# Altium project PCB_3U_DDS.PrjPCB (part 2 of 5)

## Sheet DDS_OUT_channel.SchDoc: Output stage :
size 420 x 297 mm; Author: G.K.; CompanyName: WUT; DrawnBy: G.K.; Organization: WUT ISE; Address1: Warsaw Univeristy of Technology; Address2: Nowowiejska 15/19; DocumentNumber: 4; Revision: -; SheetNumber: 4; SheetTotal: 7; EDA_Number: ARTIQ; Projet: ARTIQ/SINARA; ModifiedBy: -; CreateDate: XX/XX/XXXX; CheckedDate: -; Title2: Attenuator, amplifier and filter; DivGrp: ISE; Designer: G.K.; ModifiedDate: -; ProjectName: ARTIQ/SINARA
Used 4 times, as channels U_DDS_OUT_channel0, U_DDS_OUT_channel1, U_DDS_OUT_channel2, U_DDS_OUT_channel3. Parts and nets are listed once, with the designators drawn on the sheet.
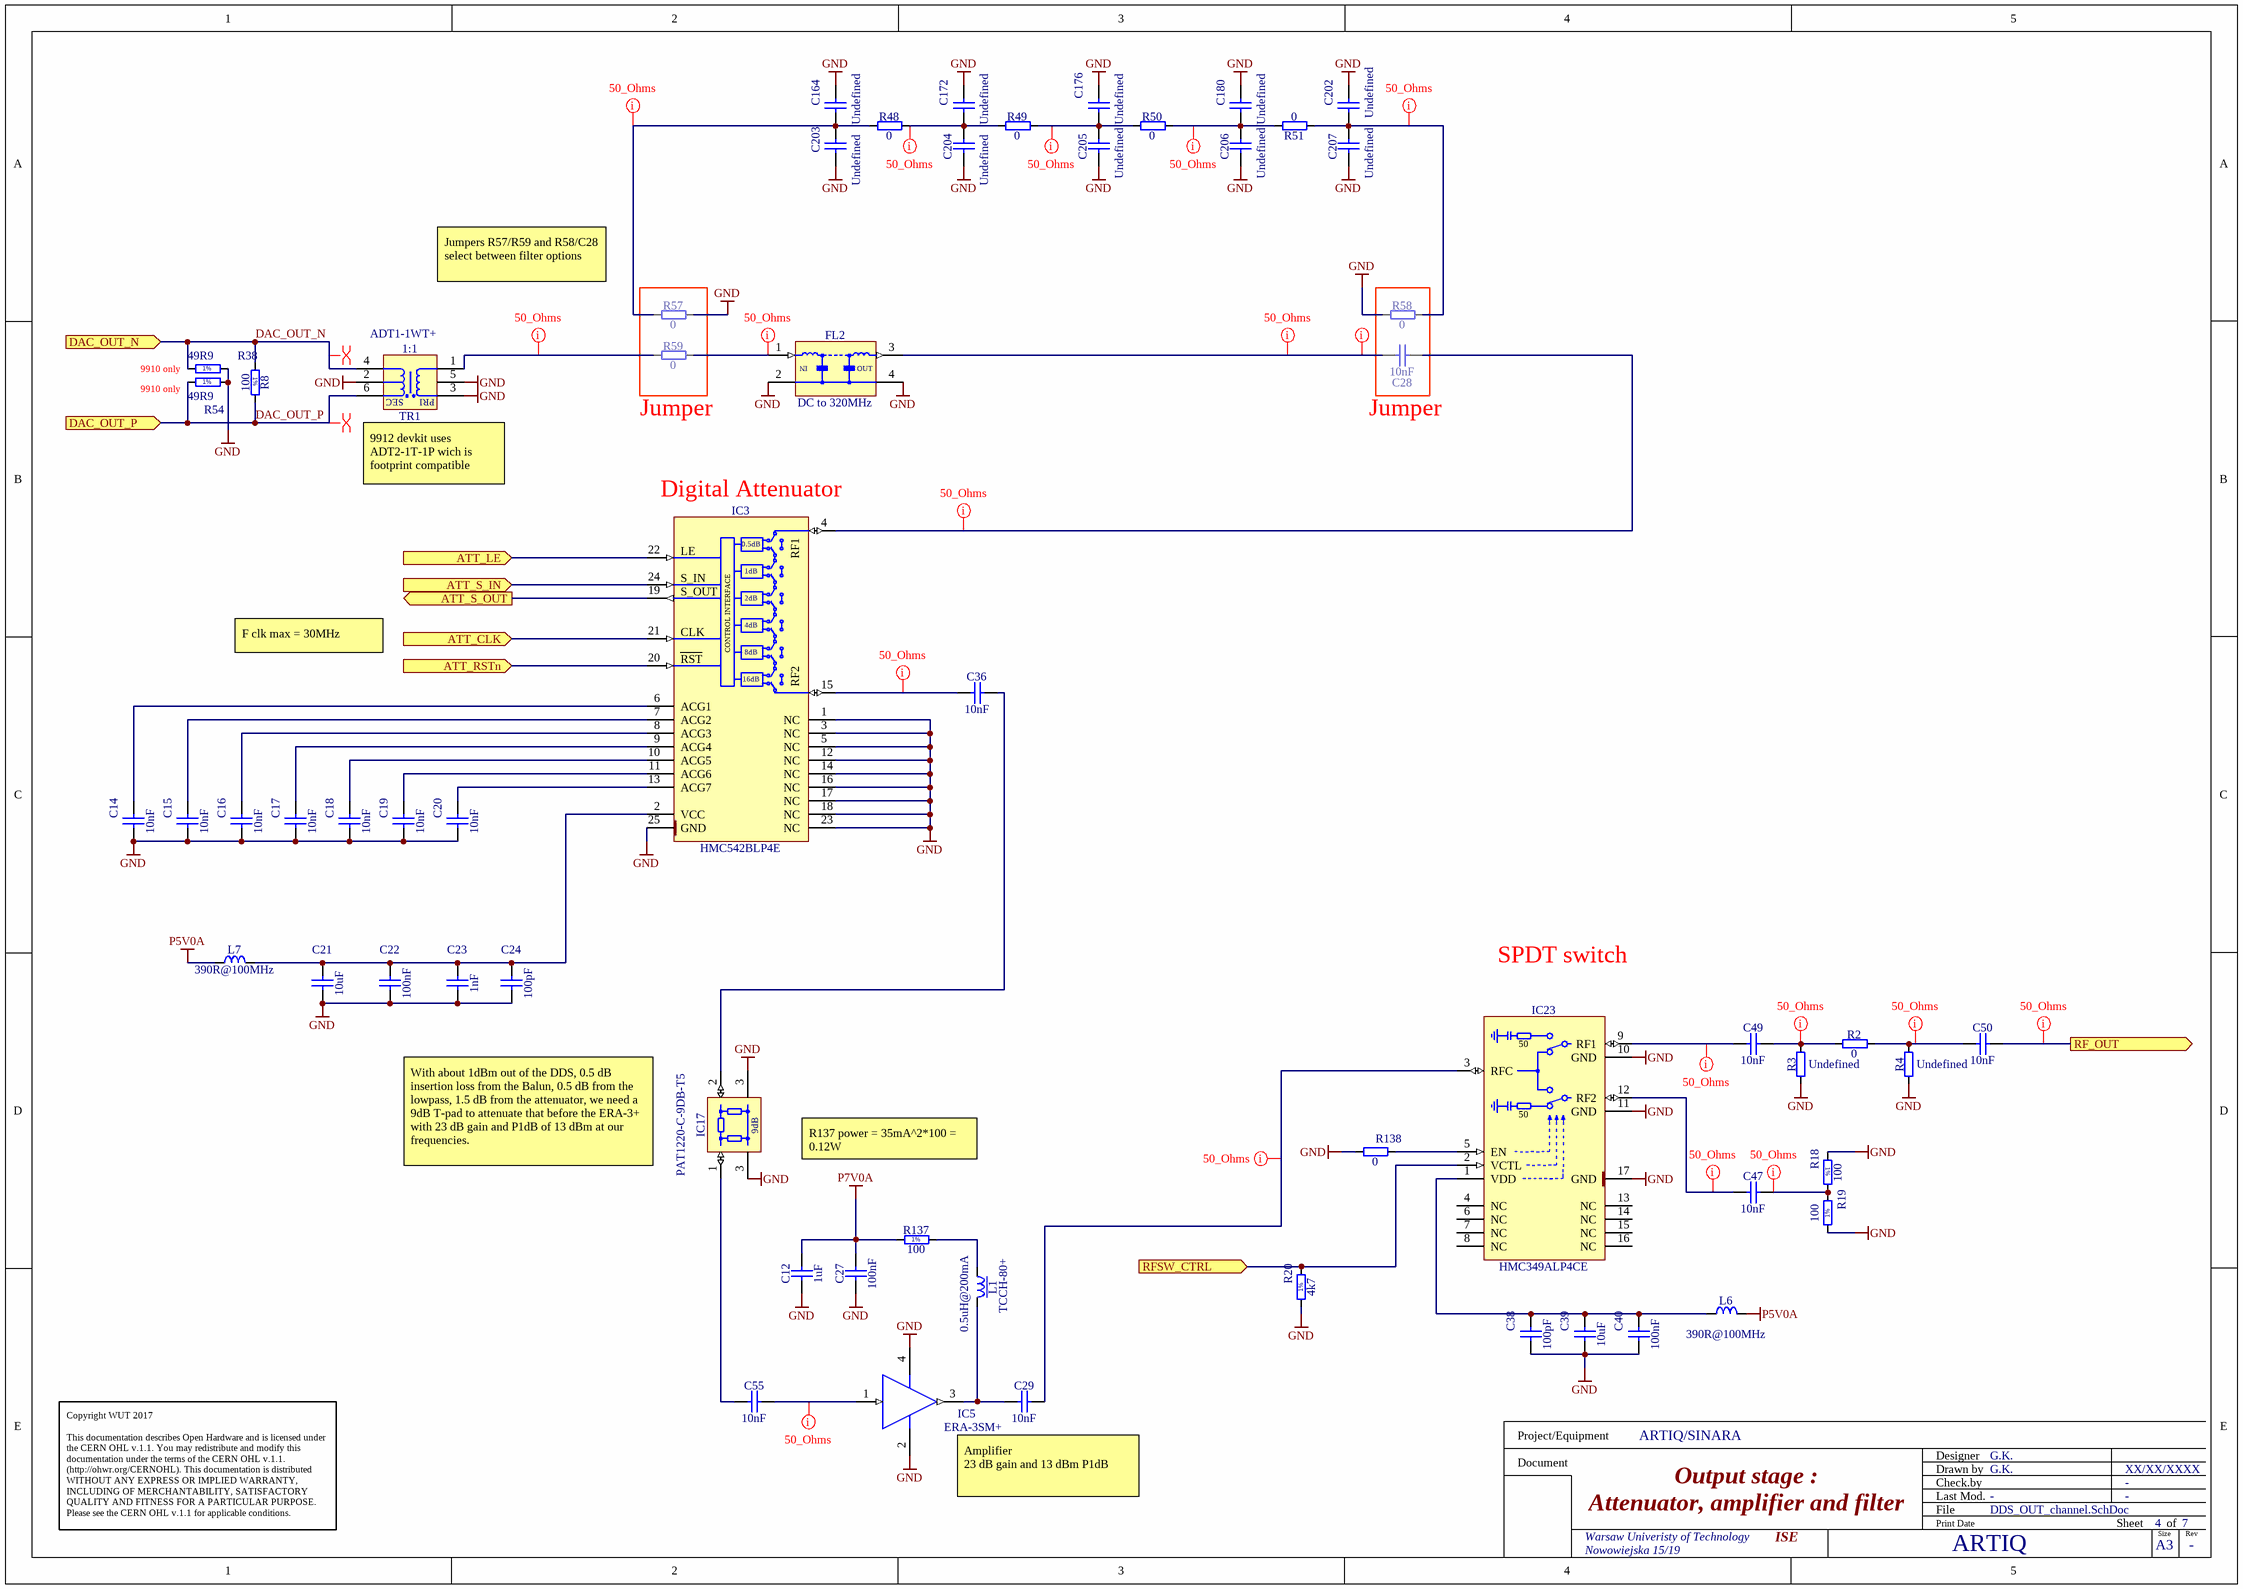
[diagram p1: DDS_OUT_channel.SchDoc]

### Parts
C12  1uF  [CAPC2012X140N]
C14  10nF  [CAPC1005X55N]
C15  10nF  [CAPC1005X55N]
C16  10nF  [CAPC1005X55N]
C17  10nF  [CAPC1005X55N]
C18  10nF  [CAPC1005X55N]
C19  10nF  [CAPC1005X55N]
C20  10nF  [CAPC1005X55N]
C21  10uF  [CAPC1608X80N]
C22  100nF  [CAPC1005X55N]
C23  1nF  [CAPC1005X55N]
C24  100pF  [CAPC1005X55N]
C27  100nF  [CAPC1005X55N]
C28  10nF  [CAPC1005X55N]
C29  10nF  [CAPC1005X55N]
C36  10nF  [CAPC1005X55N]
C38  100pF  [CAPC1005X55N]
C39  10uF  [CAPC1608X80N]
C40  100nF  [CAPC1005X55N]
C47  10nF  [CAPC1005X55N]
C49  10nF  [CAPC1005X55N]
C50  10nF  [CAPC1005X55N]
C55  10nF  [CAPC1005X55N]
C164  Undefined  [CAPC1005X55N]
C172  Undefined  [CAPC1005X55N]
C176  Undefined  [CAPC1005X55N]
C180  Undefined  [CAPC1005X55N]
C202  Undefined  [CAPC1005X55N]
C203  Undefined  [CAPC1005X55N]
C204  Undefined  [CAPC1005X55N]
C205  Undefined  [CAPC1005X55N]
C206  Undefined  [CAPC1005X55N]
C207  Undefined  [CAPC1005X55N]
FL2  DC to 320MHz  [FIL_MINI-CIRCUITS_FV1206]
IC3  HMC542BLP4E  [QFN50P400X400X100-25N-S295]
IC5  ERA-3SM+  [MINI-CIRCUITS_WW107]
IC17  PAT1220-C-9DB-T5  [SUSUMU_PAT1220]
IC23  HMC349ALP4CE  [QFN65P400X400X100-17N-S255]
L1  0.5uH@200mA  Manufacturer Part Number: TCCH-80+  [IND_MINI-CIRCUITS_GU1604]
L6  390R@100MHz  [INDC1608X95N]
L7  390R@100MHz  [INDC1608X95N]
R2  0  [RESC1005X40N]
R3  Undefined  [RESC1005X40N]
R4  Undefined  [RESC1005X40N]
R8  100  [RESC1005X40N]
R18  100  [RESC1005X40N]
R19  100  [RESC1005X40N]
R20  4k7  [RESC1005X40N]
R38  49R9  [RESC1005X40N]
R48  0  [RESC1005X40N]
R49  0  [RESC1005X40N]
R50  0  [RESC1005X40N]
R51  0  [RESC1005X40N]
R54  49R9  [RESC1005X40N]
R57  0  [RESC1005X40N]
R58  0  [RESC1005X40N]
R59  0  [RESC1005X40N]
R137  100  [RESC3216X65N]
R138  0  [RESC1005X40N]
TR1  1:1  Manufacturer Part Number: ADT1-1WT+  [XFMR_MINI-CIRCUITS_CD542]

### Ports
ATT_CLK (in), ATT_LE (in), ATT_RSTn (in), ATT_S_IN (in), ATT_S_OUT (out), DAC_OUT_N (in), DAC_OUT_P (in), RF_OUT (out), RFSW_CTRL (in)

### Nets
GND: C12.1 C14.1 C15.1 C16.1 C17.1 C18.1 C19.1 C20.1 C21.1 C22.1 C23.1 C24.1 C27.1 C38.2 C39.1 C40.1 C164.2 C172.2 C176.2 C180.2 C202.2 C203.1 C204.1 C205.1 C206.1 C207.1 FL2.2(GND) FL2.4(GND) IC3.1(NC) IC3.3(NC) IC3.5(NC) IC3.12(NC) IC3.14(NC) IC3.16(NC) IC3.17(NC) IC3.18(NC) IC3.23(NC) IC3.25(GND) IC5.2(GND) IC5.4(GND) IC17.3(GND) IC23.10(GND) IC23.11(GND) IC23.17(GND) R3.1 R4.1 R18.1 R19.1 R20.1 R38.2 R54.2 R57.2 R58.2 R138.1 TR1.2(SCT) TR1.3(PDOT) TR1.5(NC)
P5V0A: L6.2 L7.1
P7V0A: C12.2 C27.2 R137.1
ATT_CLK: IC3.21(SHIFT_CLOCK) ; port ATT_CLK
ATT_LE: IC3.22(LATCH_ENABLE) ; port ATT_LE
ATT_RSTn: IC3.20(~{RESET}) ; port ATT_RSTn
ATT_S_IN: IC3.24(SERIAL_INPUT) ; port ATT_S_IN
ATT_S_OUT: IC3.19(SERIAL_OUTPUT) ; port ATT_S_OUT
DAC_OUT_N: R8.1 R38.1 TR1.4(S) ; port DAC_OUT_N
DAC_OUT_P: R8.2 R54.1 TR1.6(SDOT) ; port DAC_OUT_P
RF_OUT: C50.2 ; port RF_OUT
RFSW_CTRL: IC23.2(VCTL) R20.2 ; port RFSW_CTRL
NetC14_2: C14.2 IC3.6(ACG1)
NetC15_2: C15.2 IC3.7(ACG2)
NetC16_2: C16.2 IC3.8(ACG3)
NetC17_2: C17.2 IC3.9(ACG4)
NetC18_2: C18.2 IC3.10(ACG5)
NetC19_2: C19.2 IC3.11(ACG6)
NetC20_2: C20.2 IC3.13(ACG7)
NetC21_2: C21.2 C22.2 C23.2 C24.2 IC3.2(VCC) L7.2
NetC28_1: C28.1 FL2.3(RFOUT)
NetC28_2: C28.2 IC3.4(RF1)
NetC29_1: C29.1 IC5.3(RF_OUT) L1.3
NetC29_2: C29.2 IC23.3(RFC)
NetC36_1: C36.1 IC3.15(RF2)
NetC36_2: C36.2 IC17.2(OUT)
NetC38_1: C38.1 C39.2 C40.2 IC23.1(VDD) L6.1
NetC47_1: C47.1 IC23.12(RF2)
NetC47_2: C47.2 R18.2 R19.2
NetC49_1: C49.1 IC23.9(RF1)
NetC49_2: C49.2 R2.1 R3.2
NetC50_1: C50.1 R2.2 R4.2
NetC55_1: C55.1 IC17.1(IN)
NetC55_2: C55.2 IC5.1(RF_IN)
NetC164_1: C164.1 C203.2 R48.1 R57.1
NetC172_1: C172.1 C204.2 R48.2 R49.1
NetC176_1: C176.1 C205.2 R49.2 R50.1
NetC180_1: C180.1 C206.2 R50.2 R51.2
NetC202_1: C202.1 C207.2 R51.1 R58.1
NetFL2_1: FL2.1(RFIN) R59.2
NetIC23_5: IC23.5(EN) R138.2
NetL1_1: L1.1 R137.2
NetR59_1: R59.1 TR1.1(P)

Not connected (* = marked no-connect by the designer): IC23 4(NC) 6(NC) 7(NC) 8(NC) 13(NC) 14(NC) 15(NC) 16(NC)

### Channels
U_DDS_OUT_channel0: designators end in A; ports ATT_CLK=ATT_CLK ATT_LE=ATT_LE ATT_RSTn=ATT_RSTn ATT_S_IN=ATT_S_IN ATT_S_OUT=NetIC3A_19 DAC_OUT_N=DAC_OUT_N DAC_OUT_P=DAC_OUT_P RF_OUT=RF_OUT0 RFSW_CTRL=RFSW_CTRL0
U_DDS_OUT_channel1: designators end in B; ports ATT_CLK=ATT_CLK ATT_LE=ATT_LE ATT_RSTn=ATT_RSTn ATT_S_IN=NetIC3A_19 ATT_S_OUT=NetIC3B_19 DAC_OUT_N=DAC_OUT_N DAC_OUT_P=DAC_OUT_P RF_OUT=RF_OUT1 RFSW_CTRL=RFSW_CTRL1
U_DDS_OUT_channel2: designators end in C; ports ATT_CLK=ATT_CLK ATT_LE=ATT_LE ATT_RSTn=ATT_RSTn ATT_S_IN=NetIC3B_19 ATT_S_OUT=NetIC3C_19 DAC_OUT_N=DAC_OUT_N DAC_OUT_P=DAC_OUT_P RF_OUT=RF_OUT2 RFSW_CTRL=RFSW_CTRL2
U_DDS_OUT_channel3: designators end in D; ports ATT_CLK=ATT_CLK ATT_LE=ATT_LE ATT_RSTn=ATT_RSTn ATT_S_IN=NetIC3C_19 ATT_S_OUT=ATT_S_OUT DAC_OUT_N=DAC_OUT_N DAC_OUT_P=DAC_OUT_P RF_OUT=RF_OUT3 RFSW_CTRL=RFSW_CTRL3

### Layout directives
net class 50_Ohms: NetC28A_1, NetC28A_2, NetC29A_2, NetC36A_1, NetC47A_1, NetC47A_2, NetC49A_1, NetC49A_2, NetC50A_1, NetC55A_2, NetC164A_1, NetC172A_1, NetC176A_1, NetC180A_1, NetC202A_1, NetFL2A_1, NetR59A_1, RF_OUT0
differential pair: DAC_OUT_N, DAC_OUT_P

### Notes on the sheet
- Jumpers R57/R59 and R58/C28 select between filter options
- 9910 only
- (near R59) Jumper
- (near C28) Jumper
- (near TR1) 9912 devkit uses ADT2-1T-1P wich is footprint compatible
- (near IC3) Digital Attenuator
- F clk max = 30MHz
- SPDT switch
- With about 1dBm out of the DDS, 0.5 dB insertion loss from the Balun, 0.5 dB from the lowpass, 1.5 dB from the attenuator, we need a 9dB T-pad to attenuate that before the ERA-3+ with 23 dB gain and P1dB of 13 dBm at our frequencies.
- R137 power = 35mA^2*100 = 0.12W
- Copyright WUT 2017
  This documentation describes Open Hardware and is licensed under the CERN OHL v.1.1. You may redistribute and modify this documentation under the terms of the CERN OHL v.1.1. (http://ohwr.org/CERNOHL). This documentation is distributed WITHOUT ANY EXPRESS OR IMPLIED WARRANTY, INCLUDING OF MERCHANTABILITY, SATISFACTORY QUALITY AND FITNESS FOR A PARTICULAR PURPOSE. Please see the CERN OHL v.1.1 for applicable conditions.
- Amplifier
  23 dB gain and 13 dBm P1dB
- Project/Equipment
- Document
- Designer
- Drawn by
- Check.by
- File
- Last Mod.
- Print Date
- Sheet
- Size
- A3
- of
- Rev
- (in symbol FIL_MINI-CIRCUITS_LFCN-320) IN; OUT
- (in symbol HMC349ALP4CE) 50
- (in symbol HMC542BLP4E) 0.5dB; LE; 1dB; S_IN; S_OUT; 2dB; CONTROL INTERFACE; 4dB; CLK; 8dB; RST; 16dB
- (in symbol R0402_4K7_1%_0.0625W_100PPM) 1%
- (in symbol R0402_49R9_1%_0.0625W_100PPM) 1%
- (in symbol R0402_100R_1%_0.0625W_100PPM) 1%
- (in symbol R1206_100R_1%_0.5W_100PPM_VISHAY_CRCW-HP e3) 1%
- (in symbol RF_PAT1220-C-9DB-T5) 9dB
- (in symbol XFMR_MINI-CIRCUITS_ADT1-1WT+) SEC; PRI

### Library data of the parts
C12 = CC0805_1UF_35V_20%_X7R: Non-polarised capacitor; Part Description: SMD Multilayer Chip Ceramic Capacitor; Manufacturer: GENERIC; Manufacturer1 Part Number: GMK212B7105MG-T; Voltage: 35V; TC: X7R; Tolerance: ±20%; Part Number: CC0805_1UF_35V_20%_X7R; Component Kind: Standard; Component Type: Standard; Pin Count: 2; Value: 1uF; Status: Not Recommended; Manufacturer Part Number: CC0805_1UF_35V_20%_X7R; Case: 0805; Mounted: Yes; Socket: No; SMD: Yes; Sense: No; Manufacturer1 Example: TAIYO YUDEN; Manufacturer1 ComponentHeight: 1.35mm; HelpURL: \\cern.ch\dfs\Applications\Altium\Datasheets\CC0805_X7R_TAIYO-YUDEN_HIGH-VALUE.pdf; Author: CERN DEM JLC; CreateDate: 2011-06-22; LatestRevisionDate: 2011-06-22
C14-C20 C28 C29 C36 C47 C49 C50 C55 = CC0402_10NF_16V_10%_X7R: Non-polarised capacitor; Part Description: SMD Multilayer Chip Ceramic Capacitor; Manufacturer: GENERIC; Manufacturer1 Part Number: 223878715636; Voltage: 16V; TC: X7R; Tolerance: ±10%; Part Number: CC0402_10NF_16V_10%_X7R; Component Kind: Standard; Component Type: Standard; Pin Count: 2; Value: 10nF; Status: Not Recommended; Manufacturer Part Number: CC0402_10NF_16V_10%_X7R; Case: 0402; Mounted: Yes; Socket: No; SMD: Yes; Sense: No; Manufacturer1 Example: PHYCOMP; Manufacturer1 ComponentHeight: 0.55mm; HelpURL: \\cern.ch\dfs\Applications\Altium\Datasheets\CC0402_X7R_PHYCOMP.pdf; Author: CERN DEM JLC; CreateDate: 2007-12-03; LatestRevisionDate: 2007-12-03
C21 C39 = CC0603_10UF_16V_20%_X5R: Non-polarised capacitor; Part Description: SMD Multilayer Chip Ceramic Capacitor; Manufacturer: GENERIC; Manufacturer1 Part Number: GRM188R61C106MA73D; Voltage: 16V; TC: X5R; Tolerance: ±20%; Part Number: CC0603_10UF_16V_20%_X5R; Component Kind: Standard; Component Type: Standard; Pin Count: 2; Value: 10uF; Status: None; Manufacturer Part Number: CC0603_10UF_16V_20%_X5R; Case: 0603; Mounted: Yes; Socket: No; SMD: Yes; Sense: No; Manufacturer1 Example: MURATA; Manufacturer1 ComponentHeight: 0.8mm; HelpURL: \\cern.ch\dfs\Applications\Altium\Datasheets\CC0603_X5R_MURATA_GRM.pdf; Author: CERN DEM MR; CreateDate: 2016-03-02; LatestRevisionDate: 2016-03-02
C22 = CC0402_100NF_16V_10%_X7R: Non-polarised capacitor; Part Description: SMD Multilayer Chip Ceramic Capacitor; Manufacturer: GENERIC; Manufacturer1 Part Number: GRM155R71C104KA88D; Voltage: 16V; TC: X7R; Tolerance: ±10%; Part Number: CC0402_100NF_16V_10%_X7R; Component Kind: Standard; Component Type: Standard; Pin Count: 2; Value: 100nF; Status: Not Recommended; Manufacturer Part Number: CC0402_100NF_16V_10%_X7R; Case: 0402; Mounted: Yes; Socket: No; SMD: Yes; Sense: No; Manufacturer1 Example: MURATA; Manufacturer1 ComponentHeight: 0.55mm; HelpURL: \\cern.ch\dfs\Applications\Altium\Datasheets\CC0402_X7R_MURATA_GRM.pdf; Author: CERN DEM JLC; CreateDate: 2013-12-05; LatestRevisionDate: 2007-12-03
C23 = CC0402_1NF_50V_10%_X7R: Non-polarised capacitor; Part Description: SMD Multilayer Chip Ceramic Capacitor; Manufacturer: GENERIC; Manufacturer1 Part Number: 223858715623; Voltage: 50V; TC: X7R; Tolerance: ±10%; Part Number: CC0402_1NF_50V_10%_X7R; Component Kind: Standard; Component Type: Standard; Pin Count: 2; Value: 1nF; Status: Not Recommended; Manufacturer Part Number: CC0402_1NF_50V_10%_X7R; Case: 0402; Mounted: Yes; Socket: No; SMD: Yes; Sense: No; Manufacturer1 Example: PHYCOMP; Manufacturer1 ComponentHeight: 0.55mm; HelpURL: \\cern.ch\dfs\Applications\Altium\Datasheets\CC0402_X7R_PHYCOMP.pdf; Author: CERN DEM JLC; CreateDate: 2007-12-03; LatestRevisionDate: 2007-12-03
C24 C38 = CC0402_100PF_50V_5%_C0G: Non-polarised capacitor; Part Description: SMD Multilayer Chip Ceramic Capacitor; Manufacturer: GENERIC; Manufacturer1 Part Number: C0402C101J5GACTU; Voltage: 50V; TC: C0G/NP0; Tolerance: ±5%; Part Number: CC0402_100PF_50V_5%_C0G; Component Kind: Standard; Component Type: Standard; Pin Count: 2; Value: 100pF; Status: Preferred; Manufacturer Part Number: CC0402_100PF_50V_5%_C0G; Case: 0402; Mounted: Yes; Socket: No; SMD: Yes; Sense: No; Manufacturer1 Example: KEMET; Manufacturer1 ComponentHeight: 0.55mm; HelpURL: \\cern.ch\dfs\Applications\Altium\Datasheets\CC0805_C0G_KEMET_(Commercial Grade).pdf; Author: CERN DEM JLC; CreateDate: 2007-12-03; LatestRevisionDate: 2015-04-22
C27 C40 = CC0402_100NF_16V_10%_X5R: Non-polarised capacitor; Part Description: SMD Multilayer Chip Ceramic Capacitor; Manufacturer: GENERIC; Manufacturer1 Part Number: GRM155R61C104KA88D; Voltage: 16V; TC: X5R; Tolerance: ±10%; Part Number: CC0402_100NF_16V_10%_X5R; Component Kind: Standard; Component Type: Standard; Pin Count: 2; Value: 100nF; Status: None; Manufacturer Part Number: CC0402_100NF_16V_10%_X5R; Case: 0402; Mounted: Yes; Socket: No; SMD: Yes; Sense: No; Manufacturer1 Example: MURATA; Manufacturer1 ComponentHeight: 0.55mm; HelpURL: \\cern.ch\dfs\Applications\Altium\Datasheets\CC0402_X5R_MURATA_GRM.pdf; Author: CERN DEM JLC; CreateDate: 10.12.2013; LatestRevisionDate: 10.12.2013
C164 C172 C176 C180 C202-C207 = CC0402_NO-VALUE: Non-polarised capacitor; Part Description: Reserved Footprint For 0402(1005) Chip Ceramic Capacitor; Mounted: No; Part Number: CC0402_NO-VALUE; Component Kind: Standard; Component Type: Standard; Pin Count: 2; Value: Undefined; Status: None; Manufacturer: Undefined; Manufacturer Part Number: CC0402_NO-VALUE; Case: 0402; Socket: No; SMD: Yes; Sense: No; Manufacturer1 ComponentHeight: 0.55mm; HelpURL: Undefined; Author: CERN DEM JLC; CreateDate: 14.01.2014; LatestRevisionDate: 14.01.2014
FL2 = FIL_MINI-CIRCUITS_LFCN-320: 50 Ohm DC to 320MHz Low Pass Filter; Part Description: 50 Ohm Low Pass Filter; Part Number: FIL_MINI-CIRCUITS_LFCN-320; Component Kind: Standard; Component Type: Standard; Pin Count: 2; Value: DC to 320MHz; Status: None; Manufacturer: MINI-CIRCUITS; Manufacturer Part Number: LFCN-320; Mounted: Yes; Socket: No; SMD: Yes; Sense: No; ComponentHeight: 0.94mm; HelpURL: \\cern.ch\dfs\Applications\Altium\Datasheets\FIL_MINI-CIRCUITS_LFCN-3000+.pdf; Author: CERN DEM JLC; CreateDate: 2013-12-09; LatestRevisionDate: 2013-12-09
IC3 = HMC542BLP4E: 0.5dB LSB GaAs MMIC 6-bit Digital Serial Control Attenuator, DC - 4GHz; Part Description: 0.5dB LSB GaAs MMIC 6-bit Digital Serial Control Attenuator, DC to 4GHz; Manufacturer: HITTITE MICROWAVE CORP; PressFit: No; Bonding: No; Part Number: HMC542BLP4E; Component Kind: Standard; Component Type: Standard; Device: HMC542BLP4E; PackageDescription: QFN, 0.50mm Pitch, Square; 24 Pin, 4.00mm L X 4.00mm W X 1.00mm H Body (w/thermal Tab 2.95 X 2.95mm), IPC Medium Density; Manufacturer Part Number: HMC542BLP4E; Pin Count: 25; Case: QFN24; Mounted: Yes; Socket: No; SMD: Yes; Sense: No; ComponentHeight: 1mm; Author: CERN DEM JMW; HelpURL: \\cern.ch\dfs\Applications\Altium\Datasheets\HMC542BLP4E.pdf; CreateDate: 2016-08-17; LatestRevisionDate: 2016-08-17
IC5 = RF_ERA-3SM+: DC-3GHz Monolithic Amplifier; Manufacturer: MINI-CIRCUITS; PressFit: No; Bonding: No; Part Number: ERA-3SM+; Component Kind: Standard; Component Type: Standard; Device: ERA-3SM+; PackageDescription: MINI-CIRCUITS WW107 Case, Body 2.16mm Diameter X 1.52mm H; Part Description: DC-3GHz Monolithic Amplifier; Manufacturer Part Number: ERA-3SM+; Pin Count: 4; Mounted: Yes; Socket: No; SMD: Yes; Sense: No; ComponentHeight: 1.52mm; Author: GK; HelpURL: \\cern.ch\dfs\Applications\Altium\Datasheets\ERA-4XSM+.pdf; CreateDate: 11.08.2016; LatestRevisionDate: 11.08.2016
IC17 = RF_PAT1220-C-9DB-T5: DC to 10GHz, 100mw, 50 Ohm, 9dB, Precision chip attenuator; Part Description: DC to 10GHz, 100mw, 50 Ohm, 9dB, Precision Chip 3dB Attenuator; Manufacturer: SUSUMU; PressFit: No; Sense Comment: Solder Paste Deposition Limitation; Bonding: No; Part Number: PAT1220-C-9DB-T5; Component Kind: Standard; Component Type: Standard; Device: PAT1220-C-9DB-T5; Footprint: SUSUMU_PAT1220-C-9DB-T5; PackageDescription: SUSUMU PAT1220, 4 Pin Attenuator, Sise 0402, L 1.00 x W 0.5 H 0.39mm; Status: Recommended; Manufacturer Part Number: PAT1220-C-9DB-T5; Pin Count: 4; Case: 0402; Mounted: Yes; Socket: No; SMD: Yes; Sense: Yes; ComponentHeight: 0.39mm; Author: GK; HelpURL: \\cern.ch\dfs\Applications\Altium\Datasheets\PAT0510S-C-9DB-T10.pdf; CreateDate: 09.03.2017; LatestRevisionDate: 02.05.2017
IC23 = HMC349ALP4CE: DC-4GHz High Isolation SPDT Non-Reflective Switch; Manufacturer: ANALOG DEVICES; PressFit: No; Bonding: No; Part Number: HMC349ALP4CE; Component Kind: Standard; Component Type: Standard; Device: HMC349ALP4CE; PackageDescription: QFN, 0.65mm pitch,square; 4 pin X 4 pin, 4mm X 4mm X 1mm H body (w/thermal tab 2.55 X 2.55mm),  IPC Medium Density; Part Description: DC-4GHz High Isolation SPDT Non-Reflective Switch; Manufacturer Part Number: HMC349ALP4CE; Pin Count: 17; Case: QFN16; Mounted: Yes; Socket: No; SMD: Yes; Sense: No; ComponentHeight: 1mm; Author: CERN DEM JLC; HelpURL: \\cern.ch\dfs\Applications\Altium\Datasheets\HMC349ALP4CE.pdf; CreateDate: 23.02.2017; LatestRevisionDate: 23.02.2017
L1 = IND_MINI-CIRCUITS_TCCH-80+: 50 Ohms, 50 to 8200 MHz RF Choke; Power: 200mA; Resistance: 0.1R; Part Number: IND_MINI-CIRCUITS_TCCH-80+; Component Kind: Standard; Component Type: Standard; Pin Count: 4; Value: 0.5uH@200mA; Status: None; Part Description: 50 Ohms, 50 to 8200 MHz RF Choke; Manufacturer: MINI-CIRCUITS; Mounted: Yes; Socket: No; SMD: Yes; Sense: No; ComponentHeight: 3.81mm; HelpURL: \\cern.ch\dfs\Applications\Altium\Datasheets\IND_MINI-CIRCUITS_TCCH-80+.pdf; Author: CERN DEM JLC; CreateDate: 2011-12-19; LatestRevisionDate: 2011-12-19
L6 L7 = IND0603_TDK_MPZ1608R391A: Inductor; Part Description: SMT Chip Bead for Power Line; Manufacturer: TDK; Power: 1.2A; Resistance: 0.12R; Tolerance: ±25%; Part Number: IND0603_TDK_MPZ1608R391A; Component Kind: Standard; Component Type: Standard; Pin Count: 2; Value: 390R@100MHz; Status: None; Manufacturer Part Number: MPZ1608R391A; Case: 0603; Mounted: Yes; Socket: No; SMD: Yes; Sense: No; ComponentHeight: 0.95mm; HelpURL: \\cern.ch\dfs\Applications\Altium\Datasheets\IND0603_TDK_MPZ1608.pdf; Author: CERN DEM JLC; CreateDate: 2009-12-02; LatestRevisionDate: 2009-12-02
R2 R48-R51 R57-R59 R138 = R0402_0R_JUMPER: Resistor; Part Description: 1A (0.05R Max DC Resistance) Zero Ohm Jumper; Manufacturer: GENERIC; Manufacturer1 Part Number: 232270591001L; Part Number: R0402_0R_JUMPER; Component Kind: Standard; Component Type: Standard; Pin Count: 2; Value: 0; Status: Not recommended; Manufacturer Part Number: R0402_0R_JUMPER; Case: 0402; Mounted: Yes; Sense: No; Socket: No; SMD: Yes; Manufacturer1 Example: YAGEO PHYCOMP; Manufacturer1 ComponentHeight: 0.4mm; HelpURL: \\cern.ch\dfs\Applications\Altium\Datasheets\R0402_Phycomp_RC0402.pdf; Author: CERN DEM JLC; CreateDate: 2007-12-03; LatestRevisionDate: 2012-10-17
R3 R4 = R0402_NO-VALUE: Resistor; Part Description: Reserved Footprint For a 0402 (1005) Chip Resistor; Mounted: No; Part Number: R0402_NO-VALUE; Component Kind: Standard; Component Type: Standard; Pin Count: 2; Value: Undefined; Status: None; Manufacturer: Undefined; Manufacturer Part Number: R0402_NO-VALUE; Case: 0402; Sense: No; Socket: No; SMD: Yes; Manufacturer1 Example: Undefined; Manufacturer1 Part Number: Undefined; Manufacturer1 ComponentHeight: Undefined; HelpURL: Undefined; Author: CERN DEM JLC; CreateDate: 03.12.2007; LatestRevisionDate: 13.03.2008
R8 R18 R19 = R0402_100R_1%_0.0625W_100PPM: Resistor - 1%; Part Description: General Purpose Thick Film Chip Resistor; Manufacturer: GENERIC; Manufacturer1 Part Number: 232270671001L; TC: ±100ppm/°C; PressFit: No; Part Number: R0402_100R_1%_0.0625W_100PPM; Component Kind: Standard; Component Type: Standard; Pin Count: 2; Value: 100; Status: Not Recommended; Power: 0.0625W; Tolerance: ±1%; Manufacturer Part Number: R0402_100R_1%_0.0625W_100PPM; Case: 0402; Mounted: Yes; Sense: No; Socket: No; SMD: Yes; Manufacturer1 Example: YAGEO PHYCOMP; Manufacturer1 ComponentHeight: 0.4mm; HelpURL: \\cern.ch\dfs\Applications\Altium\Datasheets\R0402_Phycomp_RC0402.pdf; Author: CERN DEM JLC; CreateDate: 03.12.2007; LatestRevisionDate: 17.10.2012
R20 = R0402_4K7_1%_0.0625W_100PPM: Resistor - 1%; Part Description: General Purpose Thick Film Chip Resistor; Manufacturer: GENERIC; Manufacturer1 Part Number: 232270674702L; TC: ±100ppm/°C; Part Number: R0402_4K7_1%_0.0625W_100PPM; Component Kind: Standard; Component Type: Standard; Pin Count: 2; Value: 4k7; Status: Not recommended; Power: 0.0625W; Tolerance: ±1%; Manufacturer Part Number: R0402_4K7_1%_0.0625W_100PPM; Case: 0402; Mounted: Yes; Sense: No; Socket: No; SMD: Yes; Manufacturer1 Example: YAGEO PHYCOMP; Manufacturer1 ComponentHeight: 0.4mm; HelpURL: \\cern.ch\dfs\Applications\Altium\Datasheets\R0402_Phycomp_RC0402.pdf; Author: CERN DEM JLC; CreateDate: 2007-12-03; LatestRevisionDate: 2012-10-17
R38 R54 = R0402_49R9_1%_0.0625W_100PPM: Resistor - 1%; Part Description: General Purpose Thick Film Chip Resistor; Manufacturer: GENERIC; Manufacturer1 Part Number: 232270674999L or RC0402FR-0749R9L; TC: ±100ppm/°C; PressFit: No; Part Number: R0402_49R9_1%_0.0625W_100PPM; Component Kind: Standard; Component Type: Standard; Pin Count: 2; Value: 49R9; Status: Not Recommended; Power: 0.0625W; Tolerance: ±1%; Manufacturer Part Number: R0402_49R9_1%_0.0625W_100PPM; Case: 0402; Mounted: Yes; Sense: No; Socket: No; SMD: Yes; Manufacturer1 Example: YAGEO PHYCOMP; Manufacturer1 ComponentHeight: 0.4mm; HelpURL: \\cern.ch\dfs\Applications\Altium\Datasheets\R0402_Phycomp_RC0402.pdf; Author: CERN DEM JLC; CreateDate: 24.10.2012; LatestRevisionDate: 24.10.2012
R137 = R1206_100R_1%_0.5W_100PPM_VISHAY_CRCW-HP e3: Resistor - 1%; Part Description: Pulse Proof, High Power Thick Film Chip Resistor; Manufacturer: VISHAY DRALORIC; Manufacturer Part Number: CRCW1206100RFKEAHP; Power: 0.5W; TC: ±100ppm/°C; Voltage: 200V; PressFit: No; Part Number: R1206_100R_1%_0.5W_100PPM_VISHAY_CRCW-HP e3; Component Kind: Standard; Component Type: Standard; Pin Count: 2; Value: 100; Status: None; Tolerance: ±1%; Case: 1206; Mounted: Yes; Sense: No; Socket: No; SMD: Yes; HelpURL: \\cern.ch\dfs\Applications\Altium\Datasheets\R1206_VISHAY_CRCW-HP e3.pdf; Author: CERN DEM JLC; CreateDate: 19.11.2013; LatestRevisionDate: 19.11.2013; ComponentHeight: 0.65mm
TR1 = XFMR_MINI-CIRCUITS_ADT1-1WT+: 75 Ohm 0.4 To 800MHz RF Transformers; Part Description: 75 Ohms 0.4 to 800 MHz RF Transformer; Part Number: XFMR_MINI-CIRCUITS_ADT1-1WT+; Component Kind: Standard; Component Type: Standard; Pin Count: 6; Value: 1:1; Status: None; Manufacturer: MINI-CIRCUITS; Mounted: Yes; Socket: No; Sense: No; SMD: Yes; ComponentHeight: 2.84mm; HelpURL: \\cern.ch\dfs\Applications\Altium\Datasheets\XFMR_MINI-CIRCUITS_ADT1-1WT+.pdf; Author: CERN DEM JLC; CreateDate: 21.09.2011; LatestRevisionDate: 21.09.2011

## Sheet LVDS_IFC_DDS.SchDoc: LVDS to LVTTL
size 420 x 297 mm; Author: G.K.; CompanyName: WUT; DrawnBy: G.K.; Organization: WUT ISE; Address1: Warsaw Univeristy of Technology; Address2: Nowowiejska 15/19; DocumentNumber: 2; Revision: -; SheetNumber: 2; SheetTotal: 7; EDA_Number: ARTIQ; Projet: ARTIQ/SINARA; ModifiedBy: -; CreateDate: XX/XX/XXXX; CheckedDate: -; Title2: interface & EEM connector; DivGrp: ISE; Designer: G.K.; ModifiedDate: -; ProjectName: ARTIQ/SINARA
Used 2 times, as channels U_LVDS_IFCA, U_LVDS_IFCB. Parts and nets are listed once, with the designators drawn on the sheet.
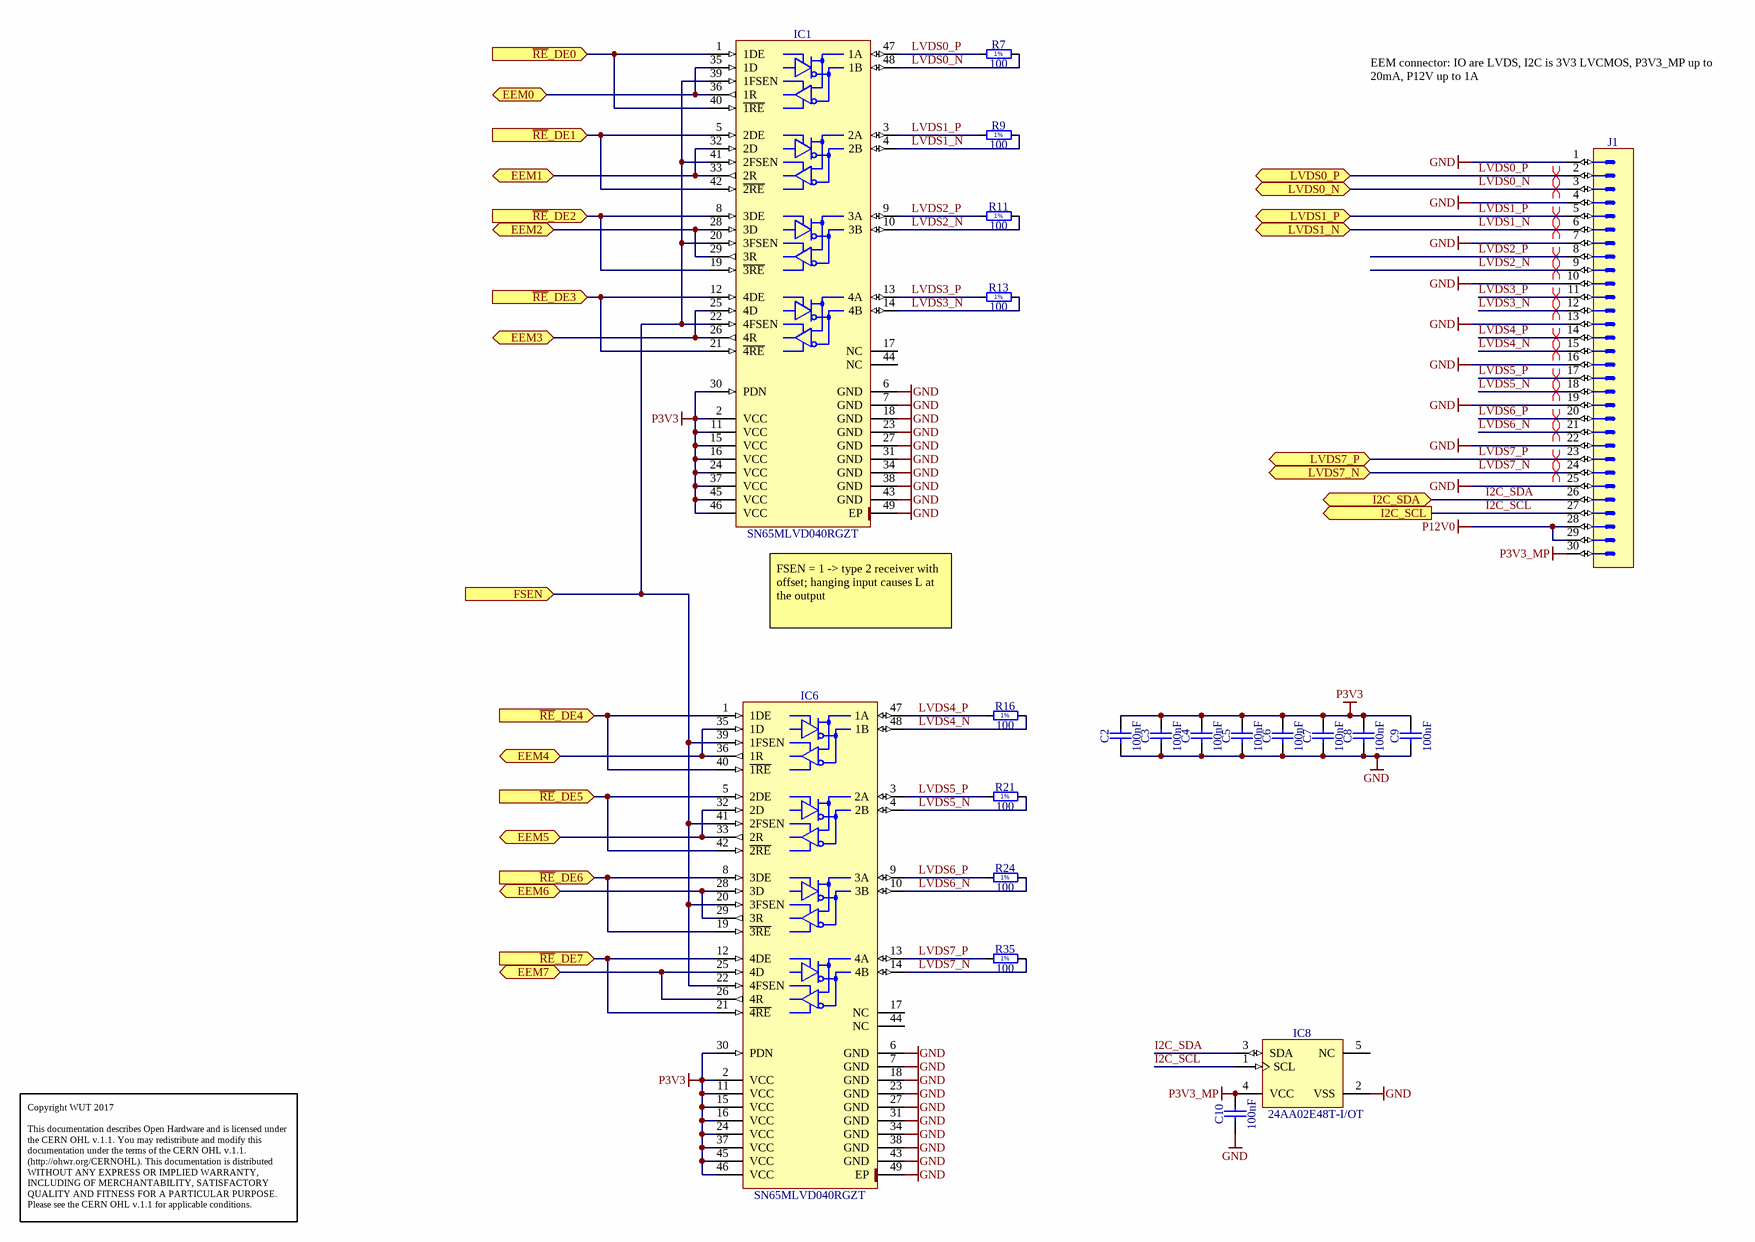
[diagram p2: LVDS_IFC_DDS.SchDoc]

### Parts
C2  100nF  [CAPC1005X55N]
C3  100nF  [CAPC1005X55N]
C4  100nF  [CAPC1005X55N]
C5  100nF  [CAPC1005X55N]
C6  100nF  [CAPC1005X55N]
C7  100nF  [CAPC1005X55N]
C8  100nF  [CAPC1005X55N]
C9  100nF  [CAPC1005X55N]
C10  100nF  [CAPC1005X55N]
IC1  SN65MLVD040RGZT  [QFN50P700X700X100-49N-S420]
IC6  SN65MLVD040RGZT  [QFN50P700X700X100-49N-S420]
IC8  24AA02E48T-I/OT  [SOT95P280X145-5N]
J1  (no value)  [3M_N2530-6002RB]
R7  100  [RESC1005X40N]
R9  100  [RESC1005X40N]
R11  100  [RESC1005X40N]
R13  100  [RESC1005X40N]
R16  100  [RESC1005X40N]
R21  100  [RESC1005X40N]
R24  100  [RESC1005X40N]
R35  100  [RESC1005X40N]

### Ports
EEM0 (bidir), EEM1 (bidir), EEM2 (bidir), EEM3 (bidir), EEM4 (bidir), EEM5 (bidir), EEM6 (bidir), EEM7 (bidir), FSEN (in), I2C_SCL (out), I2C_SDA (bidir), LVDS0_N (bidir), LVDS0_P (bidir), LVDS1_N (bidir), LVDS1_P (bidir), LVDS7_N (bidir), LVDS7_P (bidir), ~{RE}_DE0 (in), ~{RE}_DE1 (in), ~{RE}_DE2 (in), ~{RE}_DE3 (in), ~{RE}_DE4 (in), ~{RE}_DE5 (in), ~{RE}_DE6 (in), ~{RE}_DE7 (in)

### Nets
GND: C2.1 C3.1 C4.1 C5.1 C6.1 C7.1 C8.1 C9.1 C10.1 IC1.6(GND) IC1.7(GND) IC1.18(GND) IC1.23(GND) IC1.27(GND) IC1.31(GND) IC1.34(GND) IC1.38(GND) IC1.43(GND) IC1.49(EP) IC6.6(GND) IC6.7(GND) IC6.18(GND) IC6.23(GND) IC6.27(GND) IC6.31(GND) IC6.34(GND) IC6.38(GND) IC6.43(GND) IC6.49(EP) IC8.2(VSS) J1.1 J1.4 J1.7 J1.10 J1.13 J1.16 J1.19 J1.22 J1.25
P3V3: C2.2 C3.2 C4.2 C5.2 C6.2 C7.2 C8.2 C9.2 IC1.2(VCC) IC1.11(VCC) IC1.15(VCC) IC1.16(VCC) IC1.24(VCC) IC1.30(PDN) IC1.37(VCC) IC1.45(VCC) IC1.46(VCC) IC6.2(VCC) IC6.11(VCC) IC6.15(VCC) IC6.16(VCC) IC6.24(VCC) IC6.30(PDN) IC6.37(VCC) IC6.45(VCC) IC6.46(VCC)
P3V3_MP: C10.2 IC8.4(VCC) J1.30
P12V0: J1.28 J1.29
EEM0: IC1.35(1D) IC1.36(1R) ; port EEM0
EEM1: IC1.32(2D) IC1.33(2R) ; port EEM1
EEM2: IC1.28(3D) IC1.29(3R) ; port EEM2
EEM3: IC1.25(4D) IC1.26(4R) ; port EEM3
EEM4: IC6.35(1D) IC6.36(1R) ; port EEM4
EEM5: IC6.32(2D) IC6.33(2R) ; port EEM5
EEM6: IC6.28(3D) IC6.29(3R) ; port EEM6
EEM7: IC6.25(4D) IC6.26(4R) ; port EEM7
FSEN: IC1.20(3FSEN) IC1.22(4FSEN) IC1.39(1FSEN) IC1.41(2FSEN) IC6.20(3FSEN) IC6.22(4FSEN) IC6.39(1FSEN) IC6.41(2FSEN) ; port FSEN
I2C_SCL: IC8.1(SCL) J1.27 ; port I2C_SCL
I2C_SDA: IC8.3(SDA) J1.26 ; port I2C_SDA
LVDS0_N: IC1.48(1B) J1.3 R7.2 ; port LVDS0_N
LVDS0_P: IC1.47(1A) J1.2 R7.1 ; port LVDS0_P
LVDS1_N: IC1.4(2B) J1.6 R9.2 ; port LVDS1_N
LVDS1_P: IC1.3(2A) J1.5 R9.1 ; port LVDS1_P
LVDS2_N: IC1.10(3B) J1.9 R11.2
LVDS2_P: IC1.9(3A) J1.8 R11.1
LVDS3_N: IC1.14(4B) J1.12 R13.2
LVDS3_P: IC1.13(4A) J1.11 R13.1
LVDS4_N: IC6.48(1B) J1.15 R16.2
LVDS4_P: IC6.47(1A) J1.14 R16.1
LVDS5_N: IC6.4(2B) J1.18 R21.2
LVDS5_P: IC6.3(2A) J1.17 R21.1
LVDS6_N: IC6.10(3B) J1.21 R24.2
LVDS6_P: IC6.9(3A) J1.20 R24.1
LVDS7_N: IC6.14(4B) J1.24 R35.2 ; port LVDS7_N
LVDS7_P: IC6.13(4A) J1.23 R35.1 ; port LVDS7_P
~{RE}_DE0: IC1.1(1DE) IC1.40(~{1RE}) ; port ~{RE}_DE0
~{RE}_DE1: IC1.5(2DE) IC1.42(~{2RE}) ; port ~{RE}_DE1
~{RE}_DE2: IC1.8(3DE) IC1.19(~{3RE}) ; port ~{RE}_DE2
~{RE}_DE3: IC1.12(4DE) IC1.21(~{4RE}) ; port ~{RE}_DE3
~{RE}_DE4: IC6.1(1DE) IC6.40(~{1RE}) ; port ~{RE}_DE4
~{RE}_DE5: IC6.5(2DE) IC6.42(~{2RE}) ; port ~{RE}_DE5
~{RE}_DE6: IC6.8(3DE) IC6.19(~{3RE}) ; port ~{RE}_DE6
~{RE}_DE7: IC6.12(4DE) IC6.21(~{4RE}) ; port ~{RE}_DE7

Not connected (* = marked no-connect by the designer): IC1 17(NC) 44(NC); IC6 17(NC) 44(NC); IC8 5(NC)

### Channels
U_LVDS_IFCA: designators end in A; ports EEM0=NetIC1A_35 EEM1=NetIC1A_32 EEM2=NetIC1A_28 EEM3=NetIC1A_25 EEM4=NetIC6A_35 EEM5=NetIC6A_32 EEM6=NetIC6A_28 EEM7=NetIC6A_25 FSEN=NetIC1A_20 I2C_SCL=I2C_SCL I2C_SDA=I2C_SDA LVDS0_N=LVDS0_N_U_LVDS_IFCA LVDS0_P=LVDS0_P_U_LVDS_IFCA LVDS1_N=LVDS1_N_U_LVDS_IFCA LVDS1_P=LVDS1_P_U_LVDS_IFCA LVDS7_N=LVDS7_N LVDS7_P=LVDS7_P ~{RE}_DE0=~{RE}_DE0 ~{RE}_DE1=~{RE}_DE1 ~{RE}_DE2=~{RE}_DE2 ~{RE}_DE3=~{RE}_DE3 ~{RE}_DE4=~{RE}_DE4 ~{RE}_DE5=~{RE}_DE5 ~{RE}_DE6=~{RE}_DE6 ~{RE}_DE7=~{RE}_DE7
U_LVDS_IFCB: designators end in B; ports EEM0=NetIC1B_35 EEM1=NetIC1B_32 EEM2=NetIC1B_28 EEM3=NetIC1B_25 EEM4=NetIC6B_35 EEM5=NetIC6B_32 EEM6=NetIC6B_28 EEM7=NetIC6B_25 FSEN=NetIC1B_20 I2C_SCL=I2C_SCL_U_LVDS_IFCB I2C_SDA=I2C_SDA_U_LVDS_IFCB LVDS0_N=LVDS0_N LVDS0_P=LVDS0_P LVDS1_N=LVDS1_N LVDS1_P=LVDS1_P LVDS7_N=LVDS7_N_U_LVDS_IFCB LVDS7_P=LVDS7_P_U_LVDS_IFCB ~{RE}_DE0=~{RE}_DE8 ~{RE}_DE1=~{RE}_DE9 ~{RE}_DE2=~{RE}_DE10 ~{RE}_DE3=~{RE}_DE11 ~{RE}_DE4=~{RE}_DE12 ~{RE}_DE5=~{RE}_DE13 ~{RE}_DE6=~{RE}_DE14 ~{RE}_DE7=~{RE}_DE15

### Layout directives
differential pair: LVDS0_N_U_LVDS_IFCA, LVDS0_P_U_LVDS_IFCA, LVDS1_N_U_LVDS_IFCA, LVDS1_P_U_LVDS_IFCA, LVDS2_N_U_LVDS_IFCA, LVDS2_P_U_LVDS_IFCA, LVDS3_N_U_LVDS_IFCA, LVDS3_P_U_LVDS_IFCA, LVDS4_N_U_LVDS_IFCA, LVDS4_P_U_LVDS_IFCA, LVDS5_N_U_LVDS_IFCA, LVDS5_P_U_LVDS_IFCA, LVDS6_N_U_LVDS_IFCA, LVDS6_P_U_LVDS_IFCA, LVDS7_N, LVDS7_P

### Notes on the sheet
- (near J1) EEM connector: IO are LVDS, I2C is 3V3 LVCMOS, P3V3_MP up to 20mA, P12V up to 1A
- (near IC1) FSEN = 1 -> type 2 receiver with offset; hanging input causes L at the output
- Copyright WUT 2017
  This documentation describes Open Hardware and is licensed under the CERN OHL v.1.1. You may redistribute and modify this documentation under the terms of the CERN OHL v.1.1. (http://ohwr.org/CERNOHL). This documentation is distributed WITHOUT ANY EXPRESS OR IMPLIED WARRANTY, INCLUDING OF MERCHANTABILITY, SATISFACTORY QUALITY AND FITNESS FOR A PARTICULAR PURPOSE. Please see the CERN OHL v.1.1 for applicable conditions.
- Project/Equipment
- Document
- Designer
- Drawn by
- Check.by
- File
- Last Mod.
- Print Date
- Sheet
- Size
- A3
- of
- Rev
- (in symbol R0402_100R_1%_0.1W_100PPM) 1%

### Library data of the parts
C2-C10 = CC0402_100NF_16V_10%_X5R: as C27 on sheet DDS_OUT_channel; Part Number: CC0402_100NF_16V_10%_X5R; Component Kind: Standard; Component Type: Standard; Pin Count: 2; Value: 100nF; Status: None; Manufacturer Part Number: CC0402_100NF_16V_10%_X5R; Case: 0402; Mounted: Yes; Socket: No; SMD: Yes; Sense: No; Manufacturer1 Example: MURATA; Manufacturer1 ComponentHeight: 0.55mm; HelpURL: \\cern.ch\dfs\Applications\Altium\Datasheets\CC0402_X5R_MURATA_GRM.pdf; Author: CERN DEM JLC; CreateDate: 10.12.2013; LatestRevisionDate: 10.12.2013
IC1 IC6 = SN65MLVD040RGZT: 4-Channel Half-Duplex M-LVDS Line Transceiver; Manufacturer: TEXAS INSTRUMENTS; PressFit: No; Bonding: No; Part Number: SN65MLVD040RGZT; Component Kind: Standard; Component Type: Standard; Device: SN65MLVD040RGZT; PackageDescription: QFN, 0.50mm Pitch, Square; 48 Pin, 7.00mm L X 7.00mm W X 1mm H body (W/Thermal Tab 4.2mm X 4.2mm), IPC Medium Density; Part Description: 4-Channel Half-Duplex M-LVDS Line Transceiver; Manufacturer Part Number: SN65MLVD040RGZT; Pin Count: 49; Case: QFN48; Mounted: Yes; Socket: No; SMD: Yes; Sense: No; ComponentHeight: 1mm; Author: CERN DEM JLC; HelpURL: \\cern.ch\dfs\Applications\Altium\Datasheets\SN65MLVD040RGZT.pdf; CreateDate: 17.03.2011; LatestRevisionDate: 17.03.2011
IC8 = 24AA02E48T-I/OT: 1.7V-5.5V, 2K I2C Serial EEPROM With EUI-48 Node Identity; Manufacturer: MICROCHIP TECHNOLOGY; PressFit: No; Bonding: No; Part Number: 24AA02E48T-I/OT; Component Kind: Standard; Component Type: Standard; Device: 24AA02E48T-I/OT; PackageDescription: SOT, 0.95mm pitch; 5 pin, 1.60mm W X 2.90mm L X 1.45mm H body, IPC Medium Density; Part Description: 1.7V-5.5V, 2K I2C Serial EEPROM With EUI-48 Node Identity; Manufacturer Part Number: 24AA02E48T-I/OT; Pin Count: 5; Case: SOT23-5; Mounted: Yes; Socket: No; SMD: Yes; Sense: No; ComponentHeight: 1.45mm; HelpURL: \\cern.ch\dfs\Applications\Altium\Datasheets\24AA02E48T-I-OT.pdf; Author: CERN DEM MR; CreateDate: 31.03.2016; LatestRevisionDate: 31.03.2016
J1 = 3M_N2530-6002RB: Connector 30 Male; Part Description: 30 Contacts - Straight .100'' x .100'' Low Profile Four-Wall Header, 2500 Series; Manufacturer: 3M; PressFit: No; Part Number: 3M_N2530-6002RB; Component Kind: Standard; Component Type: Standard; Pin Count: 30; Family: Header 30; Mounted: Yes; Socket: No; SMD: No; Sense: No; Status: None; Manufacturer Part Number: N2530-6002RB; ComponentHeight: 10.03mm; HelpURL: \\cern.ch\dfs\Applications\Altium\Datasheets\3M_N2530-6002RB.pdf; Author: CERN DEM JLC; CreateDate: 11.02.2009; LatestRevisionDate: 11.08.2009
R7 R9 R11 R13 R16 R21 R24 R35 = R0402_100R_1%_0.1W_100PPM: Resistor - 1%; Part Description: General Purpose Thick Film Chip Resistor; Manufacturer: GENERIC; Manufacturer Part Number: R0402_100R_1%_0.1W_100PPM_50V; Manufacturer1 Part Number: ERJ2RKF1000X; Power: 0.1W; TC: ±100ppm/°C; Voltage: 50V; Part Number: R0402_100R_1%_0.1W_100PPM; Component Kind: Standard; Component Type: Standard; Pin Count: 2; Value: 100; Status: Not recommended; Tolerance: ±1%; Case: 0402; Mounted: Yes; Sense: No; Socket: No; SMD: Yes; Manufacturer1 Example: PANASONIC; Manufacturer1 ComponentHeight: 0.4mm; HelpURL: \\cern.ch\dfs\Applications\Altium\Datasheets\R0402_PANASONIC_ERJ2RK.pdf; Author: CERN DEM JLC; CreateDate: 12.12.2013; LatestRevisionDate: 03.03.2015